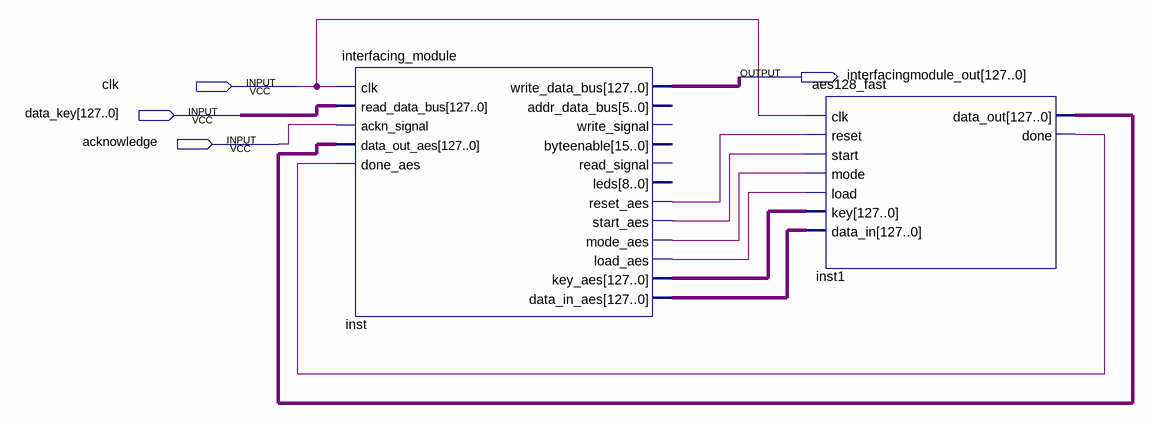
[diagram p0: schematic sheet]
// Quartus schematic test_aes.bdf as structural Verilog: 2 symbols, 4 pins
module test_aes (
  input  clk,
  input  [127:0] data_key,
  input  acknowledge,
  output [127:0] interfacingmodule_out
);

  wire inst1_done, inst_load_aes, inst_mode_aes, inst_reset_aes, inst_start_aes;
  wire [127:0] inst1_data_out, inst_data_in_aes, inst_key_aes;

  interfacing_module inst (
    .clk(clk), .read_data_bus(data_key), .ackn_signal(acknowledge), .data_out_aes(inst1_data_out),
    .done_aes(inst1_done), .write_data_bus(interfacingmodule_out), .reset_aes(inst_reset_aes),
    .start_aes(inst_start_aes), .mode_aes(inst_mode_aes), .load_aes(inst_load_aes), .key_aes(inst_key_aes),
    .data_in_aes(inst_data_in_aes));  // open: addr_data_bus, write_signal, byteenable, read_signal, leds
  aes128_fast inst1 (
    .clk(clk), .reset(inst_reset_aes), .start(inst_start_aes), .mode(inst_mode_aes), .load(inst_load_aes),
    .key(inst_key_aes), .data_in(inst_data_in_aes), .data_out(inst1_data_out), .done(inst1_done));
endmodule
